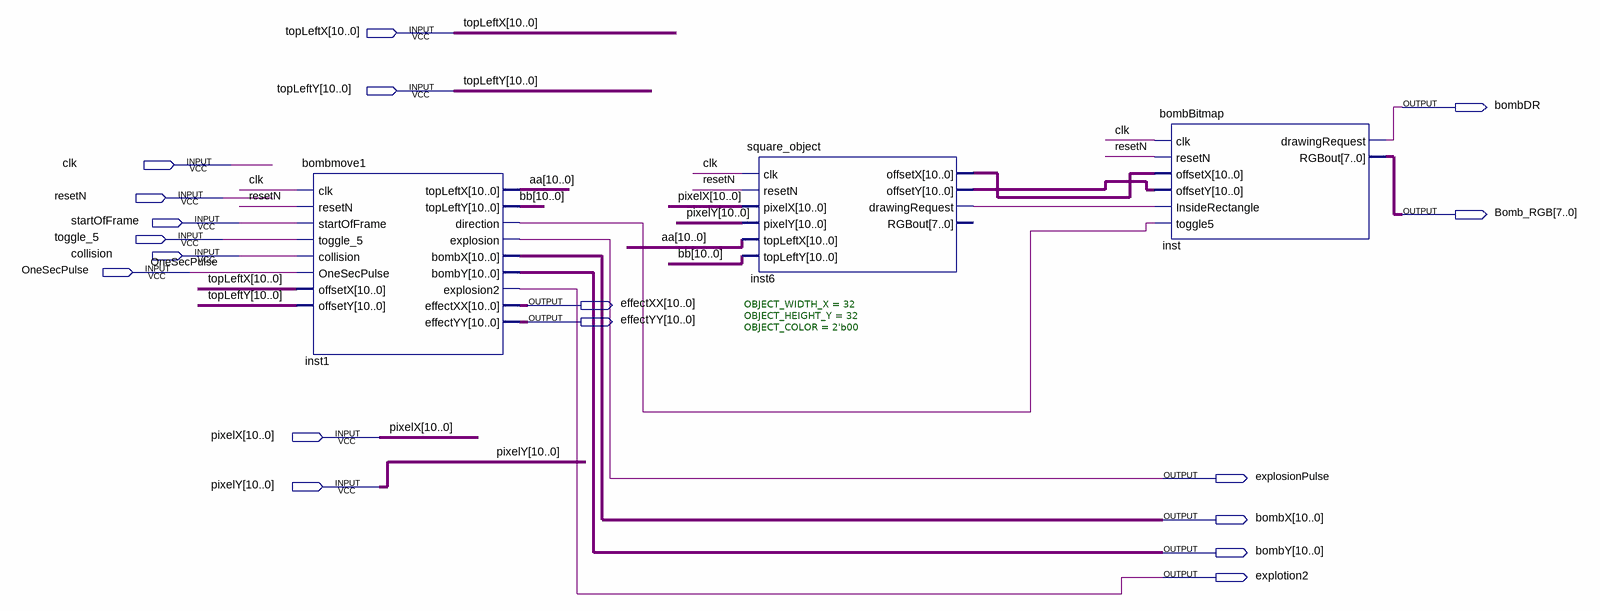
[diagram p0: schematic sheet]
// Quartus schematic BombBlock_T.bdf as structural Verilog: 3 symbols, 18 pins
module BombBlock_T (
  input  [10:0] topLeftX,
  input  [10:0] topLeftY,
  input  clk,
  input  resetN,
  input  startOfFrame,
  input  toggle_5,
  input  collision,
  input  OneSecPulse,
  input  [10:0] pixelX,
  input  [10:0] pixelY,
  output bombDR,
  output [7:0] Bomb_RGB,
  output [10:0] effectXX,
  output [10:0] effectYY,
  output explosionPulse,
  output [10:0] bombX,
  output [10:0] bombY,
  output explotion2
);

  wire inst1_direction, inst6_drawingrequest;
  wire [10:0] aa, bb, inst6_offsetx, inst6_offsety;

  bombmove1 inst1 (
    .clk(clk), .resetN(resetN), .startOfFrame(startOfFrame), .toggle_5(toggle_5), .collision(collision),
    .OneSecPulse(OneSecPulse), .offsetX(topLeftX), .offsetY(topLeftY), .topLeftX(aa), .topLeftY(bb),
    .direction(inst1_direction), .explosion(explosionPulse), .bombX(bombX), .bombY(bombY),
    .explosion2(explotion2), .effectXX(effectXX), .effectYY(effectYY));
  square_object #(.OBJECT_WIDTH_X(32), .OBJECT_HEIGHT_Y(32), .OBJECT_COLOR(2'b00)) inst6 (
    .clk(clk), .resetN(resetN), .pixelX(pixelX), .pixelY(pixelY), .topLeftX(aa), .topLeftY(bb),
    .offsetX(inst6_offsetx), .offsetY(inst6_offsety), .drawingRequest(inst6_drawingrequest));  // open: RGBout
  bombBitmap inst (
    .clk(clk), .resetN(resetN), .offsetX(inst6_offsetx), .offsetY(inst6_offsety),
    .InsideRectangle(inst6_drawingrequest), .toggle5(inst1_direction), .drawingRequest(bombDR),
    .RGBout(Bomb_RGB));
endmodule
